# Altium project smart-water-quality-breakout.PrjPcb (part 4 of 5)

## Sheet main-power.SchDoc
size Letter
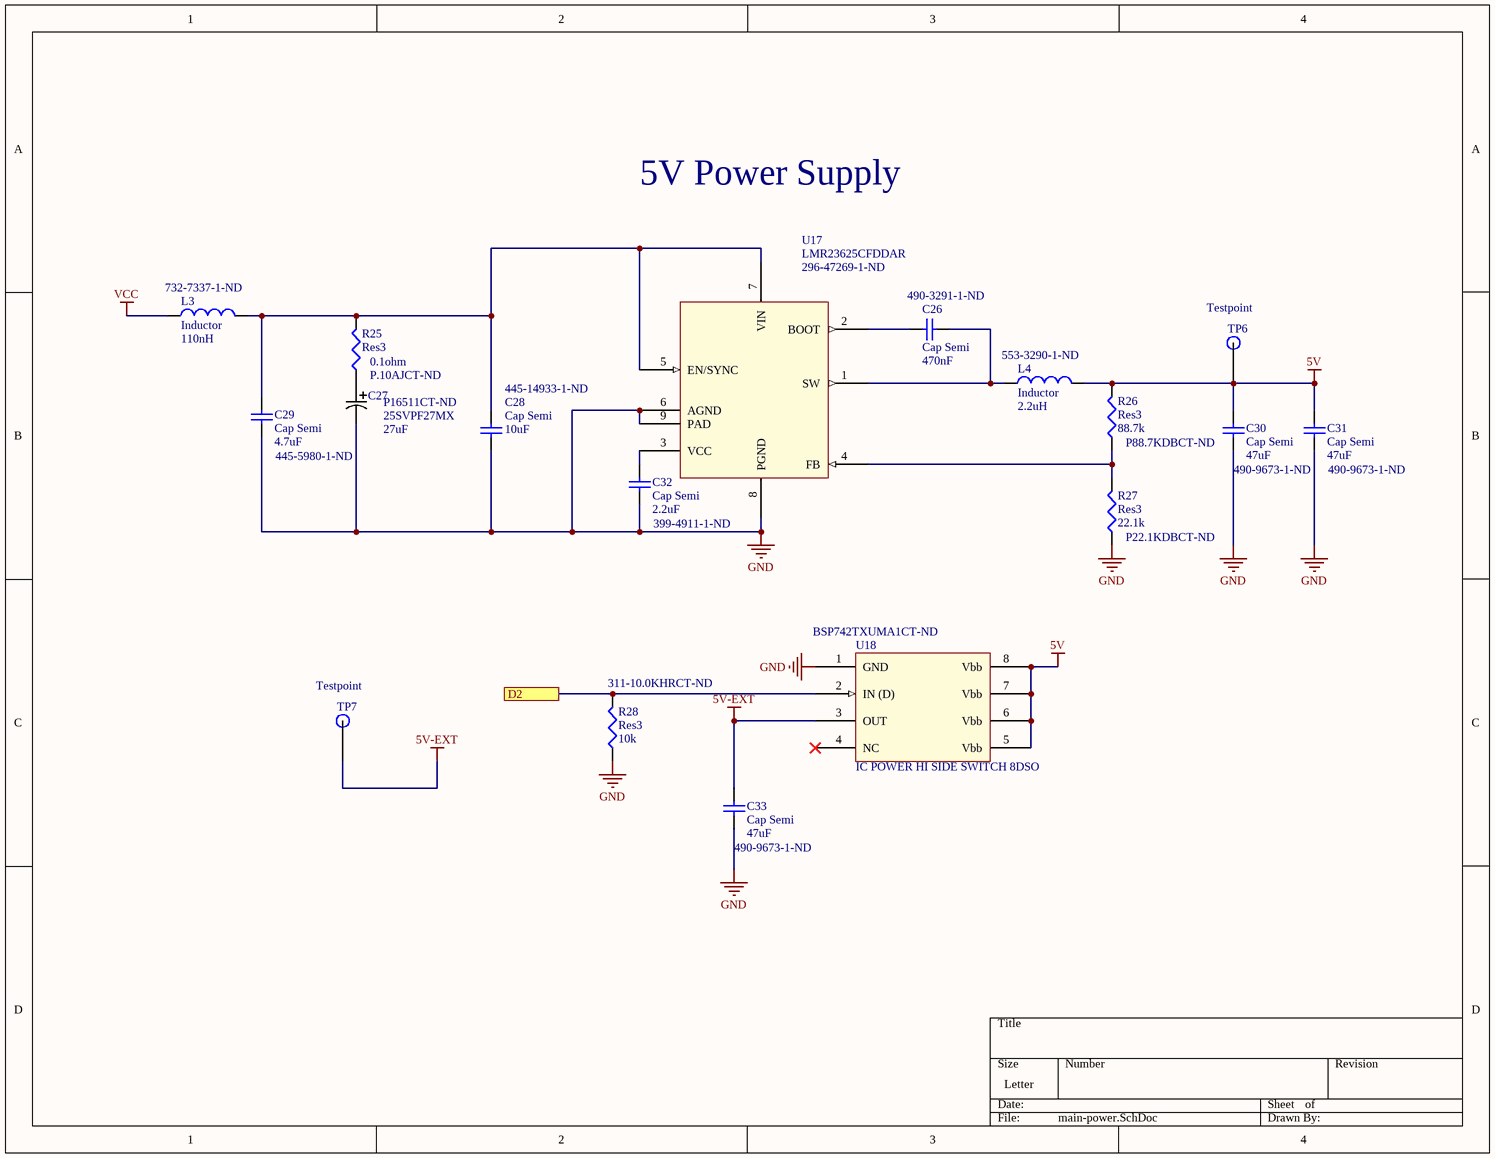
[diagram p3: main-power.SchDoc]

### Parts
C26  Cap Semi  value 470nF  Supplier Part Number 1: 490-3291-1-ND  [1608[0603]]
C27  Supplier Part Number 1: P16511CT-ND  Capacitance: 27uF  [PCAP_SVP_B6]  (hidden comment: Part Number: 25SVPF27MX)
C28  Cap Semi  value 10uF  Supplier Part Number 1: 445-14933-1-ND  [1210]
C29  Cap Semi  value 4.7uF  Supplier Part Number 1: 445-5980-1-ND  [0805C]
C30  Cap Semi  value 47uF  Supplier Part Number 1: 490-9673-1-ND  [C1206]
C31  Cap Semi  value 47uF  Supplier Part Number 1: 490-9673-1-ND  [C1206]
C32  Cap Semi  value 2.2uF  Supplier Part Number 1: 399-4911-1-ND  [1608[0603]]
C33  Cap Semi  value 47uF  Supplier Part Number 1: 490-9673-1-ND  [C1206]
L3  Inductor  value 110nH  Supplier Part Number 1: 732-7337-1-ND  [74479899111]
L4  Inductor  value 2.2uH  Supplier Part Number 1: 553-3290-1-ND  [PA4332.222NLT]
R25  Res3  value 0.1ohm  Supplier Part Number 1: P.10AJCT-ND  [J1-0603]
R26  Res3  value 88.7k  Supplier Part Number 1: P88.7KDBCT-ND  [J1-0603]
R27  Res3  value 22.1k  Supplier Part Number 1: P22.1KDBCT-ND  [J1-0603]
R28  Res3  value 10k  Supplier Part Number 1: 311-10.0KHRCT-ND  [J1-0603]
TP6  Testpoint  [testpoint]  (no BOM)
TP7  Testpoint  [testpoint]  (no BOM)
U17  LMR23625CFDDAR  Supplier Part Number 1: 296-47269-1-ND  [DDA0008E_L]
U18  IC POWER HI SIDE SWITCH 8DSO  Supplier Part Number 1: BSP742TXUMA1CT-ND  [SOIC127P600-8N]

### Ports
D2

### Nets
5V: C30.2 C31.2 L4.2 R26.2 TP6.1 U18.5(Vbb) U18.6(Vbb) U18.7(Vbb) U18.8(Vbb)
5V-EXT: C33.2 TP7.1 U18.3(OUT)
GND: C27.2 C28.1 C29.1 C30.1 C31.1 C32.1 C33.1 R27.1 R28.1 U17.6(AGND) U17.8(PGND) U17.9(PAD) U18.1(GND)
VCC: L3.1
NetC26_1: C26.1 U17.2(BOOT)
NetC26_2: C26.2 L4.1 U17.1(SW)
NetC27_1: C27.1 R25.1
NetC28_2: C28.2 C29.2 L3.2 R25.2 U17.5(EN/SYNC) U17.7(VIN)
NetC32_2: C32.2 U17.3(VCC)
NetR20_2: R28.2 U18.2(IN_(D)) ; port D2
NetR26_1: R26.1 R27.2 U17.4(FB)

Not connected (* = marked no-connect by the designer): U18 4(NC)*

### Notes on the sheet
- 5V Power Supply

### Library data of the parts
C26 = Cap Semi: Capacitor (Semiconductor SIM Model); Manufacturer: Murata; Manufacturer Part Number: GRM188R71E474KA12D; Material: Ceramic; Tolerance: 10%; Voltage Rating: 25V; Dielectric: X7R; Voltage: 50V; Published: 8-Jun-2000; LatestRevisionDate: 29-May-2009; LatestRevisionNote: IPC-7351 Footprint Added.; PackageReference: C1206; Publisher: Altium Limited; PackageDescription: Chip Capacitor; Supplier 1: Digi-Key; Stock 1: 187331; Pricing 1: 1 = 0.25000, 10 = 0.16800, 100 = 0.08520, 500 = 0.05832, 1000 = 0.05159 (USD); RoHS: Yes; Mount: Surface Mount; Case/Package: 0603; Number of Pins: 2; Case Code (Metric): 1608; Case Code (Imperial): 0603; Min Operating Temperature: -55°C; Max Operating Temperature: 125°C; Packaging: Tape and Reel; Capacitance: 470nF; Package Quantity: 4000; Voltage Rating (DC): 25V; Termination: SMD/SMT; Length: 1.6mm; Height: 0.8mm; Width: 0.031inch; Thickness: 0.035inch; Depth: 0.8mm; REACH SVHC: No SVHC; Lead Free: Lead Free; ComponentLink1URL: https://datasheet.ciiva.com/16293/grm188r71e474ka12d-16293088.pdf?src-supplier=Future+Electronics; ComponentLink1Description: https://datasheet.ciiva.com/16293/grm188r71e474ka12d-16293088.pdf?src-supplier=Future+Electronics; ComponentLink2URL: https://datasheet.ciiva.com/7937/1747458-7937650.pdf?src-supplier=Element14; ComponentLink2Description: https://datasheet.ciiva.com/7937/1747458-7937650.pdf?src-supplier=Element14; ComponentLink3URL: https://datasheet.ciiva.com/134/grm188r71e474ka12-01-134310.pdf?src-supplier=Digi-Key; ComponentLink3Description: https://datasheet.ciiva.com/134/grm188r71e474ka12-01-134310.pdf?src-supplier=Digi-Key; ComponentLink4URL: https://datasheet.ciiva.com/34302/1857559-34302862.pdf?src-supplier=Jameco; ComponentLink4Description: https://datasheet.ciiva.com/34302/1857559-34302862.pdf?src-supplier=Jameco; ComponentLink5URL: https://datasheet.ciiva.com/29199/454518-da-01-en-vs-kondensator-0603-29199596.pdf?src-supplier=Conrad; ComponentLink5Description: https://datasheet.ciiva.com/29199/454518-da-01-en-vs-kondensator-0603-29199596.pdf?src-supplier=Conrad; ComponentLink6URL: https://datasheet.ciiva.com/134/grm188r71e474ka12-01-134308.pdf?src-supplier=Digi-Key; ComponentLink6Description: https://datasheet.ciiva.com/134/grm188r71e474ka12-01-134308.pdf?src-supplier=Digi-Key; ComponentLink7URL: https://datasheet.ciiva.com/134/grm188r71e474ka12-01-134309.pdf?src-supplier=Digi-Key; ComponentLink7Description: https://datasheet.ciiva.com/134/grm188r71e474ka12-01-134309.pdf?src-supplier=Digi-Key; ComponentLink8URL: https://datasheet.ciiva.com/22703/1747458-22703340.pdf?src-supplier=Element14; ComponentLink8Description: https://datasheet.ciiva.com/22703/1747458-22703340.pdf?src-supplier=Element14
C27 = 25SVPF27MX: No Description Available; Vendor: Panasonic; Built_By: EMA_UL_Team; Type: DEV; Tolerance: 20%; Voltage Rating: 25V; ESR (Equivalent Series Resistance): 40mR; Ripple Current: 2.45A; Leakage Current: 135uA; Polarity: Polar; Life (Hours): 5000Hour; Dissipation Factor: 12%; Manufacturer_Part_Number: 25SVPF27MX; Copyright: Copyright (C) 2018 Accelerated Designs. All rights reserved; RefDes: RefDes; Value: Value; Supplier 1: Digi-Key; Manufacturer: Panasonic; Manufacturer Part Number: 25SVPF27MX; Stock 1: 3478; Pricing 1: 1 = 1.02000, 10 = 0.80900, 100 = 0.60650, 500 = 0.45826 (USD); RoHS: Yes; Mount: Surface Mount; Case/Package: Radial; Number of Pins: 6; Min Operating Temperature: -55°C; Max Operating Temperature: 105°C; Packaging: Tape and Reel; Voltage Rating (DC): 25V; Package Quantity: 1500; Ripple Current (AC): 2.45A; Termination: SMD/SMT; Voltage: 25V; Diameter: 5mm; Length: 5.9mm; Height: 5.9mm; Height - Seated (Max): 0.236inch; REACH SVHC: No SVHC; ComponentLink1URL: https://datasheet.ciiva.com/24094/svpf-os-262415-24094277.pdf?src-supplier=Mouser; ComponentLink1Description: https://datasheet.ciiva.com/24094/svpf-os-262415-24094277.pdf?src-supplier=Mouser; ComponentLink2URL: https://datasheet.ciiva.com/49031/70324301-49031162.pdf?src-supplier=Allied+Electronics; ComponentLink2Description: https://datasheet.ciiva.com/49031/70324301-49031162.pdf?src-supplier=Allied+Electronics; ComponentLink3URL: https://datasheet.ciiva.com/25746/1734360-25746540.pdf?src-supplier=Farnell; ComponentLink3Description: https://datasheet.ciiva.com/25746/1734360-25746540.pdf?src-supplier=Farnell; ComponentLink4URL: https://datasheet.ciiva.com/22746/1734360-22746216.pdf?src-supplier=Element14; ComponentLink4Description: https://datasheet.ciiva.com/22746/1734360-22746216.pdf?src-supplier=Element14
C28 = Cap Semi: Capacitor (Semiconductor SIM Model); Manufacturer: TDK; Manufacturer Part Number: C3225X7R1H106M250AC; Dielectric Material: Ceramic; Tolerance: 20%; Voltage Rating: 50V; Dielectric: X7R; Published: 8-Jun-2000; LatestRevisionDate: 29-May-2009; LatestRevisionNote: IPC-7351 Footprint Added.; PackageReference: C1206; Publisher: Altium Limited; PackageDescription: Chip Capacitor; Supplier 1: Digi-Key; Stock 1: 227657; Pricing 1: 1 = 1.57000, 10 = 1.24200, 100 = 0.93150, 500 = 0.70380 (USD); RoHS: Yes; Mount: Surface Mount; Case/Package: 1210; Weight: 0.000564oz; Case Code (Metric): 3225; Case Code (Imperial): 1210; Min Operating Temperature: -55°C; Max Operating Temperature: 125°C; Package Quantity: 1000; Packaging: Tape and Reel; Capacitance: 10uF; Termination: SMD/SMT; Voltage Rating (DC): 50V; Length: 0.126inch; Height: 2.5mm; Width: 0.098inch; Thickness: 0.11inch; REACH SVHC: No SVHC; Lead Free: Lead Free; ComponentLink1URL: http://www.farnell.com/datasheets/2291921.pdf?src-supplier=Farnell; ComponentLink1Description: http://www.farnell.com/datasheets/2291921.pdf?src-supplier=Farnell; ComponentLink2URL: http://www.mouser.com/ds/2/400/tdk_mlcc_commercial_general_en-542463.pdf?src-supplier=Mouser; ComponentLink2Description: http://www.mouser.com/ds/2/400/tdk_mlcc_commercial_general_en-542463.pdf?src-supplier=Mouser; ComponentLink3URL: https://product.tdk.com/info/en/documents/chara_sheet/C3225X7R1H106M250AC.pdf?src-supplier=Digi-Key; ComponentLink3Description: https://product.tdk.com/info/en/documents/chara_sheet/C3225X7R1H106M250AC.pdf?src-supplier=Digi-Key; ComponentLink4URL: http://product.tdk.com/capacitor/mlcc/en/documents/mlcc_commercial_general_en.pdf?src-supplier=Avnet; ComponentLink4Description: http://product.tdk.com/capacitor/mlcc/en/documents/mlcc_commercial_general_en.pdf?src-supplier=Avnet; ComponentLink5URL: http://www.farnell.com/datasheets/1913358.pdf?src-supplier=Element14; ComponentLink5Description: http://www.farnell.com/datasheets/1913358.pdf?src-supplier=Element14; ComponentLink6URL: http://www.farnell.com/datasheets/2291921.pdf?src-supplier=Newark; ComponentLink6Description: http://www.farnell.com/datasheets/2291921.pdf?src-supplier=Newark
C29 = Cap Semi: Capacitor (Semiconductor SIM Model); Manufacturer: TDK; Manufacturer Part Number: C2012X5R1H475K125AB; Dielectric Material: Ceramic; Tolerance: 10%; Voltage Rating: 50V; Dielectric: X5R; Published: 8-Jun-2000; LatestRevisionDate: 29-May-2009; LatestRevisionNote: IPC-7351 Footprint Added.; PackageReference: C1206; Publisher: Altium Limited; PackageDescription: Chip Capacitor; Supplier 1: Digi-Key; Stock 1: 412452; Pricing 1: 1 = 0.80000, 10 = 0.56600, 100 = 0.37260, 500 = 0.27600, 1000 = 0.23460 (USD); RoHS: Yes; Mount: Surface Mount; Case/Package: 0805; Weight: 0.000194oz; Case Code (Metric): 2012; Case Code (Imperial): 0805; Min Operating Temperature: -55°C; Max Operating Temperature: 85°C; Capacitance: 4.7uF; Packaging: Tape and Reel; Package Quantity: 1; Voltage Rating (DC): 50V; Termination: SMD/SMT; Composition: Ceramic; Voltage: 50V; Length: 2mm; Height: 1.25mm; Width: 0.049inch; Thickness: 0.057inch; Depth: 1.25mm; Radiation Hardening: No; REACH SVHC: No SVHC; Lead Free: Lead Free; ComponentLink1URL: https://datasheet.ciiva.com/24216/c2012x5r1h475k125ab-265006-24216434.pdf?src-supplier=Mouser; ComponentLink1Description: https://datasheet.ciiva.com/24216/c2012x5r1h475k125ab-265006-24216434.pdf?src-supplier=Mouser; ComponentLink2URL: https://datasheet.ciiva.com/28673/mlcc-commercial-general-en-28673541.pdf?src-supplier=Element14; ComponentLink2Description: https://datasheet.ciiva.com/28673/mlcc-commercial-general-en-28673541.pdf?src-supplier=Element14; ComponentLink3URL: https://datasheet.ciiva.com/17487/e412-c-17487414.pdf?src-supplier=Avnet+Europe; ComponentLink3Description: https://datasheet.ciiva.com/17487/e412-c-17487414.pdf?src-supplier=Avnet+Europe; ComponentLink4URL: https://datasheet.ciiva.com/22725/1913358-22725564.pdf?src-supplier=Element14; ComponentLink4Description: https://datasheet.ciiva.com/22725/1913358-22725564.pdf?src-supplier=Element14; ComponentLink5URL: https://datasheet.ciiva.com/6276/tdkmlcccaprange-6276526.pdf?src-supplier=Digi-Key; ComponentLink5Description: https://datasheet.ciiva.com/6276/tdkmlcccaprange-6276526.pdf?src-supplier=Digi-Key; ComponentLink6URL: https://datasheet.ciiva.com/48671/e412-c-48671374.pdf?src-supplier=Avnet; ComponentLink6Description: https://datasheet.ciiva.com/48671/e412-c-48671374.pdf?src-supplier=Avnet
C30 C31 C33 = Cap Semi: Capacitor (Semiconductor SIM Model); Manufacturer: Murata; Manufacturer Part Number: GRM31CR61A476KE15L; Material: Ceramic; Tolerance: 10%; Voltage Rating: 10V; Dielectric: X5R; Published: 8-Jun-2000; LatestRevisionDate: 29-May-2009; LatestRevisionNote: IPC-7351 Footprint Added.; PackageReference: C1206; Publisher: Altium Limited; PackageDescription: Chip Capacitor; Supplier 1: Digi-Key; Stock 1: 199340; Pricing 1: 1 = 0.84000, 10 = 0.63700, 100 = 0.45540, 500 = 0.35254, 1000 = 0.30357 (USD); RoHS: Yes; Mount: Surface Mount; Case/Package: 1206; Case Code (Metric): 3216; Case Code (Imperial): 1206; Min Operating Temperature: -55°C; Max Operating Temperature: 85°C; Package Quantity: 2000; Packaging: Tape and Reel; Capacitance: 47uF; Voltage Rating (DC): 10V; Termination: SMD/SMT; Voltage: 10V; Length: 3.2mm; Height: 1.6mm; Width: 1.6mm; Thickness: 0.071inch; Depth: 1.6mm; REACH SVHC: No SVHC; Lead Free: Lead Free; ComponentLink1URL: https://datasheet.ciiva.com/29536/grm31cr61a476ke15-01-29536840.pdf?src-supplier=Digi-Key; ComponentLink1Description: https://datasheet.ciiva.com/29536/grm31cr61a476ke15-01-29536840.pdf?src-supplier=Digi-Key; ComponentLink2URL: https://datasheet.ciiva.com/13337/product-13337807.pdf?src-supplier=Mouser; ComponentLink2Description: https://datasheet.ciiva.com/13337/product-13337807.pdf?src-supplier=Mouser; ComponentLink3URL: https://datasheet.ciiva.com/46445/1769893-46445005.pdf?src-supplier=Element14; ComponentLink3Description: https://datasheet.ciiva.com/46445/1769893-46445005.pdf?src-supplier=Element14; ComponentLink4URL: https://datasheet.ciiva.com/41860/partnumbering-e-01-41860758.pdf?src-supplier=Digi-Key; ComponentLink4Description: https://datasheet.ciiva.com/41860/partnumbering-e-01-41860758.pdf?src-supplier=Digi-Key; ComponentLink5URL: https://datasheet.ciiva.com/46445/1769893-46445004.pdf?src-supplier=Element14; ComponentLink5Description: https://datasheet.ciiva.com/46445/1769893-46445004.pdf?src-supplier=Element14
C32 = Cap Semi: Capacitor (Semiconductor SIM Model); Manufacturer: KEMET; Manufacturer Part Number: C0603C225K8PACTU; Dielectric Material: Ceramic; Tolerance: 10%; Dielectric: X5R; Voltage: 10V; Published: 8-Jun-2000; LatestRevisionDate: 29-May-2009; LatestRevisionNote: IPC-7351 Footprint Added.; PackageReference: C1206; Publisher: Altium Limited; PackageDescription: Chip Capacitor; Supplier 1: Digi-Key; Stock 1: 110745; Pricing 1: 1 = 0.24000, 10 = 0.16200, 100 = 0.08220, 500 = 0.05622, 1000 = 0.04973 (USD); RoHS: Yes; Mount: Surface Mount; Case/Package: 0603; Number of Pins: 2; Min Operating Temperature: -55°C; Max Operating Temperature: 85°C; Capacitance: 2.2uF; Packaging: Tape and Reel; Termination: SMD/SMT; Voltage Rating (DC): 10V; Length: 1.6mm; Height: 0.8mm; Depth: 0.8mm; Radiation Hardening: No; Lead Free: Lead Free; ComponentLink1URL: https://datasheet.ciiva.com/11786/0900766b8116eb59-11786922.pdf?src-supplier=RSComponents; ComponentLink1Description: https://datasheet.ciiva.com/11786/0900766b8116eb59-11786922.pdf?src-supplier=RSComponents; ComponentLink2URL: https://datasheet.ciiva.com/18192/getdatasheetpartid-104076-18192933.pdf?src-supplier=Verical; ComponentLink2Description: https://datasheet.ciiva.com/18192/getdatasheetpartid-104076-18192933.pdf?src-supplier=Verical; ComponentLink3URL: https://datasheet.ciiva.com/7824/40889-7824025.pdf?src-supplier=Element14; ComponentLink3Description: https://datasheet.ciiva.com/7824/40889-7824025.pdf?src-supplier=Element14; ComponentLink4URL: https://datasheet.ciiva.com/26847/getdatasheetpartid-316295-26847626.pdf?src-supplier=Verical; ComponentLink4Description: https://datasheet.ciiva.com/26847/getdatasheetpartid-316295-26847626.pdf?src-supplier=Verical
L3 = Inductor: Manufacturer: Wurth Electronics; Code_IEC: 1005; Current Rating: 4A; Shielding: Shielded; DC Resistance (DCR): 7mR; Self Resonant Frequency: 300MHz; Test Frequency: 1MHz; Tolerance: 20%; Published: 8-Jun-2000; LatestRevisionDate: 29-May-2009; LatestRevisionNote: IPC-7351 Footprint Added.; PackageReference: 0402-A; Publisher: Altium Limited; PackageDescription: Chip Inductor; Code_JEITA: 0402; Supplier 1: Digi-Key; Manufacturer Part Number: 74479899111; Stock 1: 5231; Pricing 1: 1 = 1.06000, 10 = 1.04200, 50 = 0.94100, 100 = 0.90700, 500 = 0.84000, 1000 = 0.77300 (USD); RoHS: Yes; Mount: Surface Mount; Case/Package: 1210; Case Code (Metric): 3225; Case Code (Imperial): 1210; Min Operating Temperature: -40°C; Max Operating Temperature: 125°C; Packaging: Tape and Reel; Inductance: 110nH; Saturation Current: 4A; Length: 0.126inch; Width: 0.102inch; Height - Seated (Max): 0.047inch; ComponentLink1URL: https://katalog.we-online.de/pbs/datasheet/74479899111.pdf?src-supplier=Digi-Key; ComponentLink1Description: https://katalog.we-online.de/pbs/datasheet/74479899111.pdf?src-supplier=Digi-Key
L4 = Inductor: Manufacturer: Pulse Electronics; Code_IEC: 1005; Core Material: Ferrite; Current Rating: 4.3A; Saturation Current: 6.1A; Shielding: Shielded; DC Resistance (DCR): 48mR; Self Resonant Frequency: 25MHz; Test Frequency: 1MHz; Tolerance: 20%; Published: 8-Jun-2000; LatestRevisionDate: 29-May-2009; LatestRevisionNote: IPC-7351 Footprint Added.; PackageReference: 0402-A; Publisher: Altium Limited; PackageDescription: Chip Inductor; Code_JEITA: 0402; Supplier 1: Digi-Key; Manufacturer Part Number: PA4332.222NLT; Stock 1: 9240; Pricing 1: 1 = 0.64000, 10 = 0.56400, 100 = 0.40250, 500 = 0.33810, 1000 = 0.27370 (USD); RoHS: Yes; Mount: Surface Mount; Case/Package: Nonstandard; Min Operating Temperature: -40°C; Max Operating Temperature: 125°C; Packaging: Tape and Reel; Composition: Wirewound; Inductance: 2.2uH; Length: 0.165inch; Width: 0.165inch; Height - Seated (Max): 0.079inch; ComponentLink1URL: http://products.pulseelex.com/files/product_files/P761.pdf?src-supplier=Digi-Key; ComponentLink1Description: http://products.pulseelex.com/files/product_files/P761.pdf?src-supplier=Digi-Key
R25 = Res3: Resistor; Manufacturer: Panasonic; Manufacturer Part Number: ERJ3RSFR10V; Resistance: 100mR; Power Rating: 100mW; Tolerance: 1%; Temperature Coefficient: 300ppm/°C; Published: 8-Jun-2000; LatestRevisionDate: 29-May-2009; LatestRevisionNote: IPC-7351 Footprint Added.; PackageReference: J1-0603; Publisher: Altium Limited; PackageDescription: Chip Resistor; Supplier 1: Digi-Key; Stock 1: 499056; Pricing 1: 1 = 0.31000, 10 = 0.26200, 25 = 0.19040, 50 = 0.13800, 100 = 0.10230, 250 = 0.07852, 500 = 0.06186, 1000 = 0.04283 (USD); RoHS: Yes; Mount: Surface Mount; Case/Package: 0603; Number of Pins: 2; Case Code (Metric): 1608; Case Code (Imperial): 0603; Contact Plating: Tin; Min Operating Temperature: -55°C; Max Operating Temperature: 125°C; Packaging: Tape and Reel; Package Quantity: 5000; Composition: Thick Film; Number of Terminations: 2; Termination: SMD/SMT; Military Standard: Not; Max Power Dissipation: 100mW; Length: 1.6mm; Height: 0.45mm; Width: 0.031inch; Depth: 0.8mm; Radiation Hardening: No; REACH SVHC: No SVHC; Lead Free: Lead Free; ComponentLink1URL: https://datasheet.ciiva.com/11818/0900766b80eefa12-11818379.pdf?src-supplier=RSComponents; ComponentLink1Description: https://datasheet.ciiva.com/11818/0900766b80eefa12-11818379.pdf?src-supplier=RSComponents; ComponentLink2URL: https://datasheet.ciiva.com/9186/aoa0000ce3-9186678.pdf?src-supplier=Avnet; ComponentLink2Description: https://datasheet.ciiva.com/9186/aoa0000ce3-9186678.pdf?src-supplier=Avnet; ComponentLink3URL: https://datasheet.ciiva.com/28577/391509-28577782.pdf?src-supplier=Element14; ComponentLink3Description: https://datasheet.ciiva.com/28577/391509-28577782.pdf?src-supplier=Element14; ComponentLink4URL: https://datasheet.ciiva.com/30245/6aoa0000ce3-30245798.pdf?src-supplier=Onlinecomponents.com; ComponentLink4Description: https://datasheet.ciiva.com/30245/6aoa0000ce3-30245798.pdf?src-supplier=Onlinecomponents.com; ComponentLink5URL: https://datasheet.ciiva.com/6137/391509-6137623.pdf?src-supplier=Farnell; ComponentLink5Description: https://datasheet.ciiva.com/6137/391509-6137623.pdf?src-supplier=Farnell; ComponentLink6URL: https://datasheet.ciiva.com/16396/aoa0000ce3-16396839.pdf?src-supplier=Future+Electronics; ComponentLink6Description: https://datasheet.ciiva.com/16396/aoa0000ce3-16396839.pdf?src-supplier=Future+Electronics; ComponentLink7URL: https://datasheet.ciiva.com/17208/aoa0000ce3-17208042.pdf?src-supplier=Avnet+Europe; ComponentLink7Description: https://datasheet.ciiva.com/17208/aoa0000ce3-17208042.pdf?src-supplier=Avnet+Europe; ComponentLink8URL: https://datasheet.ciiva.com/24027/aoa0000ce3-72189-24027996.pdf?src-supplier=Mouser; ComponentLink8Description: https://datasheet.ciiva.com/24027/aoa0000ce3-72189-24027996.pdf?src-supplier=Mouser; ComponentLink9URL: https://datasheet.ciiva.com/46449/391509-46449485.pdf?src-supplier=Element14; ComponentLink9Description: https://datasheet.ciiva.com/46449/391509-46449485.pdf?src-supplier=Element14; ComponentLink10URL: https://datasheet.ciiva.com/16771/70068852-16771902.pdf?src-supplier=Allied+Electronics; ComponentLink10Description: https://datasheet.ciiva.com/16771/70068852-16771902.pdf?src-supplier=Allied+Electronics; ComponentLink11URL: https://datasheet.ciiva.com/46449/391509-46449486.pdf?src-supplier=Element14; ComponentLink11Description: https://datasheet.ciiva.com/46449/391509-46449486.pdf?src-supplier=Element14; ComponentLink12URL: https://datasheet.ciiva.com/28667/391509-28667695.pdf?src-supplier=Element14; ComponentLink12Description: https://datasheet.ciiva.com/28667/391509-28667695.pdf?src-supplier=Element14
R26 = Res3: Resistor; Manufacturer: Panasonic; Manufacturer Part Number: ERA3AEB8872V; Tolerance: 0.1%; Resistance: 88.7kR; Temperature Coefficient: 25ppm/°C; Power Rating: 100mW; Voltage Rating: 75V; Published: 8-Jun-2000; LatestRevisionDate: 29-May-2009; LatestRevisionNote: IPC-7351 Footprint Added.; PackageReference: J1-0603; Publisher: Altium Limited; PackageDescription: Chip Resistor; Supplier 1: Digi-Key; Stock 1: 25375; Pricing 1: 1 = 0.35000, 10 = 0.30000, 100 = 0.11720, 1000 = 0.04906, 2500 = 0.04498 (USD); RoHS: Yes; Mount: Surface Mount; Case/Package: 0603; Number of Pins: 2; Contact Plating: Tin; Case Code (Imperial): 0603; Case Code (Metric): 1608; Min Operating Temperature: -55°C; Max Operating Temperature: 155°C; Composition: Metal Film; Packaging: Tape and Reel; Package Quantity: 1; Number of Terminations: 2; Military Standard: Not; Max Power Dissipation: 100mW; Voltage Rating (DC): 75V; Features: Automotive AEC-Q200; Length: 1.6mm; Height: 0.45mm; Width: 0.8mm; Depth: 0.8mm; Radiation Hardening: No; Lead Free: Lead Free; ComponentLink1URL: https://datasheet.ciiva.com/11810/0900766b80eb1d8c-11810560.pdf?src-supplier=RSComponents; ComponentLink1Description: https://datasheet.ciiva.com/11810/0900766b80eb1d8c-11810560.pdf?src-supplier=RSComponents; ComponentLink2URL: https://datasheet.ciiva.com/7920/485442-7920389.pdf?src-supplier=Element14; ComponentLink2Description: https://datasheet.ciiva.com/7920/485442-7920389.pdf?src-supplier=Element14; ComponentLink3URL: https://datasheet.ciiva.com/6053/485442-6053174.pdf?src-supplier=Farnell; ComponentLink3Description: https://datasheet.ciiva.com/6053/485442-6053174.pdf?src-supplier=Farnell; ComponentLink4URL: https://datasheet.ciiva.com/6053/485442-6053175.pdf?src-supplier=Farnell; ComponentLink4Description: https://datasheet.ciiva.com/6053/485442-6053175.pdf?src-supplier=Farnell; ComponentLink5URL: https://datasheet.ciiva.com/6053/485442-6053177.pdf?src-supplier=Farnell; ComponentLink5Description: https://datasheet.ciiva.com/6053/485442-6053177.pdf?src-supplier=Farnell; ComponentLink6URL: https://datasheet.ciiva.com/17208/aoa0000ce26-17208382.pdf?src-supplier=Avnet+Europe; ComponentLink6Description: https://datasheet.ciiva.com/17208/aoa0000ce26-17208382.pdf?src-supplier=Avnet+Europe
R27 = Res3: Resistor; Manufacturer: Panasonic; Manufacturer Part Number: ERA-3AEB2212V; Tolerance: 0.1%; Resistance: 22.1kR; Power Rating: 100mW; Voltage Rating: 150V; Temperature Coefficient: 25ppm/°C; Voltage Rating (DC): 75V; Published: 8-Jun-2000; LatestRevisionDate: 29-May-2009; LatestRevisionNote: IPC-7351 Footprint Added.; PackageReference: J1-0603; Publisher: Altium Limited; PackageDescription: Chip Resistor; Supplier 1: Digi-Key; Stock 1: 138256; Pricing 1: 1 = 0.35000, 10 = 0.30000, 100 = 0.11720, 1000 = 0.04906, 2500 = 0.04498 (USD); RoHS: Yes; Mount: Surface Mount; Case/Package: 0603; Number of Pins: 2; Case Code (Metric): 1608; Case Code (Imperial): 0603; Contact Plating: Tin; Min Operating Temperature: -55°C; Max Operating Temperature: 155°C; Packaging: Tape and Reel; Package Quantity: 1; Composition: Thin Film; Number of Terminations: 2; Military Standard: Not; Max Power Dissipation: 100mW; Features: Automotive AEC-Q200; Termination: SMD/SMT; Length: 1.6mm; Height: 0.45mm; Width: 0.8mm; Depth: 0.8mm; Radiation Hardening: No; REACH SVHC: No SVHC; Lead Free: Lead Free; ComponentLink1URL: https://datasheet.ciiva.com/11810/0900766b80eb1d8c-11810643.pdf?src-supplier=RSComponents; ComponentLink1Description: https://datasheet.ciiva.com/11810/0900766b80eb1d8c-11810643.pdf?src-supplier=RSComponents; ComponentLink2URL: https://datasheet.ciiva.com/29183/452175-da-01-en-widerstand-0603-era-29183955.pdf?src-supplier=Conrad; ComponentLink2Description: https://datasheet.ciiva.com/29183/452175-da-01-en-widerstand-0603-era-29183955.pdf?src-supplier=Conrad; ComponentLink3URL: https://datasheet.ciiva.com/17210/aoa0000ce26-17210837.pdf?src-supplier=Avnet+Europe; ComponentLink3Description: https://datasheet.ciiva.com/17210/aoa0000ce26-17210837.pdf?src-supplier=Avnet+Europe; ComponentLink4URL: https://datasheet.ciiva.com/5998/485442-5998316.pdf?src-supplier=Farnell; ComponentLink4Description: https://datasheet.ciiva.com/5998/485442-5998316.pdf?src-supplier=Farnell; ComponentLink5URL: https://datasheet.ciiva.com/9191/aoa0000ce26-9191805.pdf?src-supplier=Avnet; ComponentLink5Description: https://datasheet.ciiva.com/9191/aoa0000ce26-9191805.pdf?src-supplier=Avnet; ComponentLink6URL: https://datasheet.ciiva.com/5998/485442-5998319.pdf?src-supplier=Farnell; ComponentLink6Description: https://datasheet.ciiva.com/5998/485442-5998319.pdf?src-supplier=Farnell; ComponentLink7URL: https://datasheet.ciiva.com/46422/485442-46422607.pdf?src-supplier=Element14; ComponentLink7Description: https://datasheet.ciiva.com/46422/485442-46422607.pdf?src-supplier=Element14
R28 = Res3: Resistor; Manufacturer: Yageo; Manufacturer Part Number: RC0603FR-0710KL; Tolerance: 1%; Resistance: 10kR; Temperature Coefficient: 100ppm/°C; Voltage Rating (DC): 50V; Power Rating: 100mW; Voltage Rating: 75V; Published: 8-Jun-2000; LatestRevisionDate: 29-May-2009; LatestRevisionNote: IPC-7351 Footprint Added.; PackageReference: J1-0603; Publisher: Altium Limited; PackageDescription: Chip Resistor; Supplier 1: Digi-Key; Stock 1: 90146690; Pricing 1: 1 = 0.10000, 10 = 0.02400, 100 = 0.00970, 1000 = 0.00437, 2500 = 0.00379 (USD); RoHS: Yes; Case/Package: 0603; Number of Pins: 2; Weight: 7.1E-05oz; Case Code (Imperial): 0603; Case Code (Metric): 1608; Min Operating Temperature: -55°C; Max Operating Temperature: 155°C; Composition: Thick Film; Packaging: Tape and Reel; Military Standard: Not; Termination: SMD/SMT; Length: 1.6mm; Height: 0.45mm; Width: 0.8mm; Depth: 0.8mm; Lead Pitch: 0.3mm; REACH SVHC: No SVHC; Lead Free: Lead Free; ComponentLink1URL: https://datasheet.ciiva.com/7660/38590-7660789.pdf?src-supplier=Element14; ComponentLink1Description: https://datasheet.ciiva.com/7660/38590-7660789.pdf?src-supplier=Element14; ComponentLink2URL: https://datasheet.ciiva.com/15189/getdatasheetpartid-409289-15189591.pdf?src-supplier=Verical; ComponentLink2Description: https://datasheet.ciiva.com/15189/getdatasheetpartid-409289-15189591.pdf?src-supplier=Verical; ComponentLink3URL: https://datasheet.ciiva.com/46440/1868787-46440891.pdf?src-supplier=Element14; ComponentLink3Description: https://datasheet.ciiva.com/46440/1868787-46440891.pdf?src-supplier=Element14; ComponentLink4URL: https://datasheet.ciiva.com/7983/443971-7983596.pdf?src-supplier=Element14; ComponentLink4Description: https://datasheet.ciiva.com/7983/443971-7983596.pdf?src-supplier=Element14; ComponentLink5URL: https://datasheet.ciiva.com/7746/1738695-7746239.pdf?src-supplier=Element14; ComponentLink5Description: https://datasheet.ciiva.com/7746/1738695-7746239.pdf?src-supplier=Element14; ComponentLink6URL: https://datasheet.ciiva.com/22747/443971-22747519.pdf?src-supplier=Element14; ComponentLink6Description: https://datasheet.ciiva.com/22747/443971-22747519.pdf?src-supplier=Element14
TP6 TP7 = SMT Testpoint
U17 = LMR23625CFDDAR: Manufacturer: Texas Instruments; Quiescent Current: 75uA; Supplier 1: Digi-Key; Manufacturer Part Number: LMR23625CFDDAR; Stock 1: 6768; Pricing 1: 1 = 3.24000, 10 = 2.91200, 100 = 2.38610, 500 = 2.03124, 1000 = 1.71310 (USD); RoHS: No; Min Operating Temperature: -40°C; Max Operating Temperature: 125°C; Lead Free: Lead Free; ComponentLink1URL: http://www.ti.com/lit/ds/symlink/lmr23625.pdf?src-supplier=Digi-Key; ComponentLink1Description: http://www.ti.com/lit/ds/symlink/lmr23625.pdf?src-supplier=Digi-Key
U18 = BSP742TXUMA1: Manufacturer: Infineon; Output Current: 800mA; Number of Outputs: 1; Nominal Supply Current: 1mA; Max Power Dissipation: 1.5W; Max Supply Voltage: 34V; Supplier 1: Digi-Key; Manufacturer Part Number: BSP742TXUMA1; Stock 1: 10093; Pricing 1: 1 = 1.73000, 10 = 1.53200, 100 = 1.21050, 500 = 0.93878, 1000 = 0.74115 (USD); RoHS: Yes; Mount: Surface Mount; Number of Pins: 8; Min Operating Temperature: -40°C; Max Operating Temperature: 150°C; Packaging: Tape and Reel; Number of Channels: 1; Power Dissipation: 1.5W; Radiation Hardening: No; Lead Free: Lead Free; Halogen Free: Halogen Free; ComponentLink1URL: http://components.arrow.com/part/dataview/52118417S8296913N2051?src-supplier=Arrow; ComponentLink1Description: http://components.arrow.com/part/dataview/52118417S8296913N2051?src-supplier=Arrow; ComponentLink2URL: http://www.farnell.com/datasheets/2333312.pdf?src-supplier=Farnell; ComponentLink2Description: http://www.farnell.com/datasheets/2333312.pdf?src-supplier=Farnell; ComponentLink3URL: http://components.arrow.com/part/dataview/0323_00171565?src-supplier=Arrow+Europe; ComponentLink3Description: http://components.arrow.com/part/dataview/0323_00171565?src-supplier=Arrow+Europe; ComponentLink4URL: http://www.mouser.com/ds/2/196/Infineon-BSP742T-DS-v01_03-EN-1111163.pdf?src-supplier=Mouser; ComponentLink4Description: http://www.mouser.com/ds/2/196/Infineon-BSP742T-DS-v01_03-EN-1111163.pdf?src-supplier=Mouser; ComponentLink5URL: http://www.infineon.com/dgdl/Infineon-BSP742T-DS-v01_03-en.pdf?fileId=db3a30431689f4420116d2efc3000bf7&ack=t&src-supplier=Avnet; ComponentLink5Description: http://www.infineon.com/dgdl/Infineon-BSP742T-DS-v01_03-en.pdf?fileId=db3a30431689f4420116d2efc3000bf7&ack=t&src-supplier=Avnet; ComponentLink6URL: https://www.infineon.com/dgdl/Infineon-BSP742T-DS-v01_03-EN.pdf?fileId=5546d4625a888733015aae0b51d34c49&src-supplier=Digi-Key; ComponentLink6Description: https://www.infineon.com/dgdl/Infineon-BSP742T-DS-v01_03-EN.pdf?fileId=5546d4625a888733015aae0b51d34c49&src-supplier=Digi-Key; ComponentLink7URL: http://www.farnell.com/datasheets/2333312.pdf?src-supplier=Newark; ComponentLink7Description: http://www.farnell.com/datasheets/2333312.pdf?src-supplier=Newark

## Sheet gps.SchDoc
size Letter
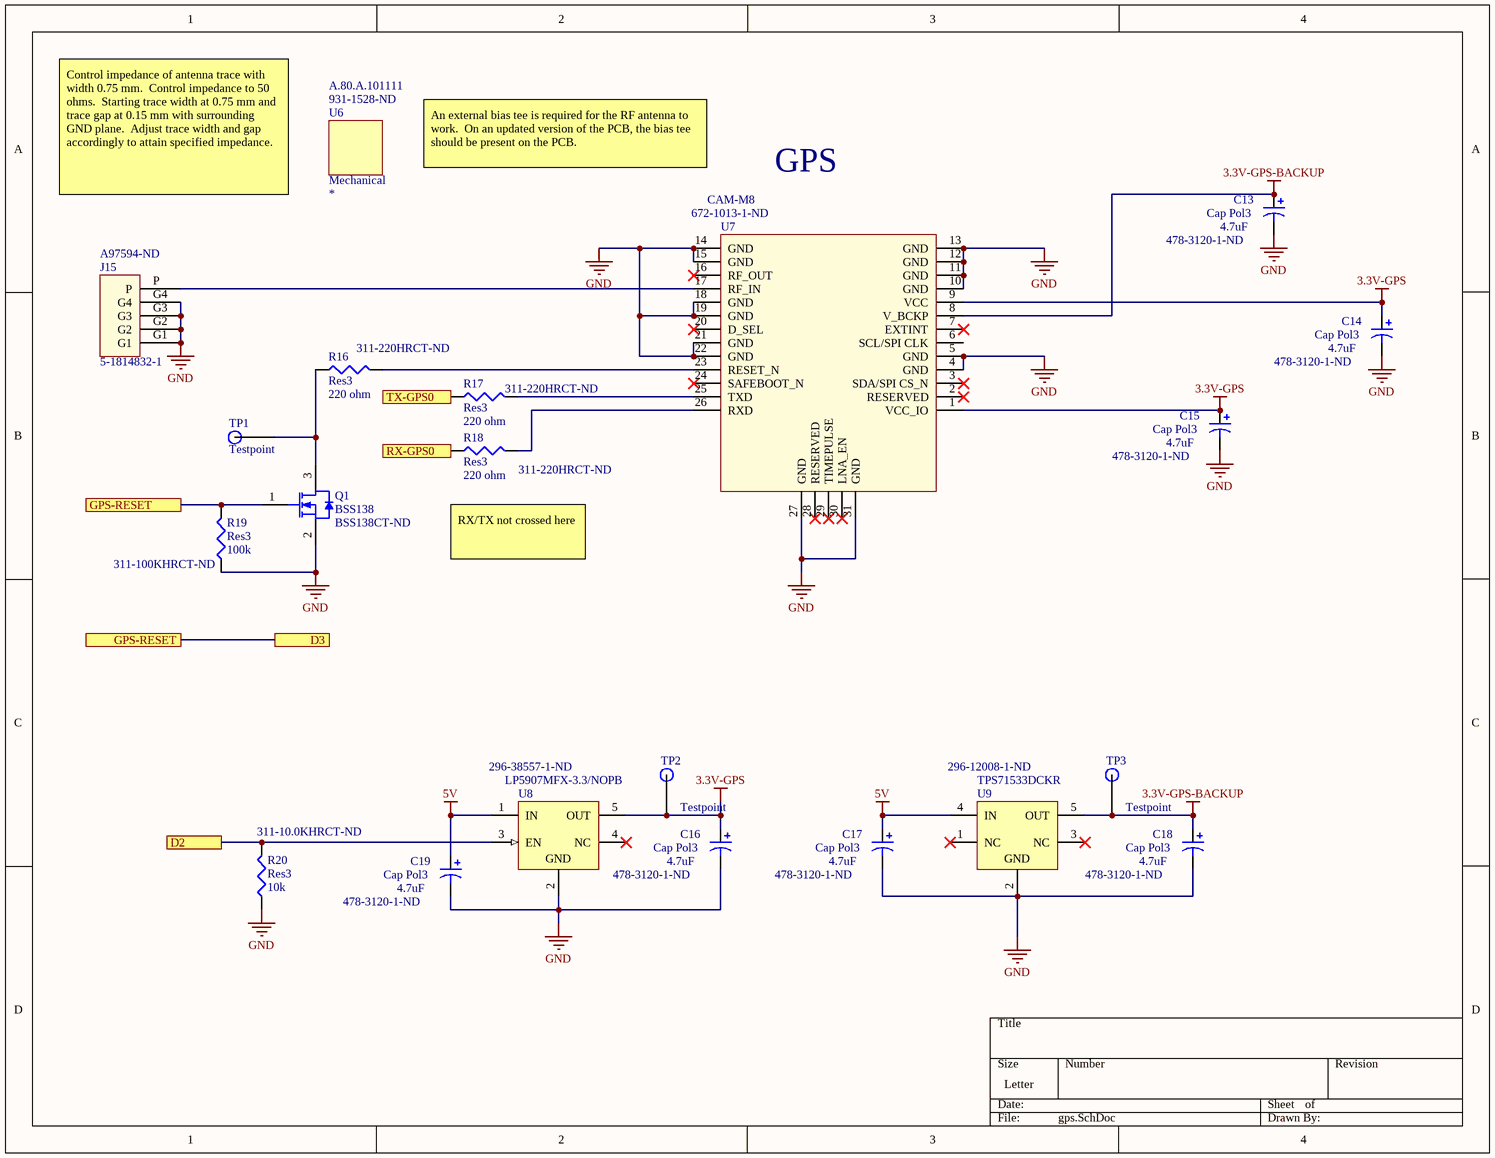
[diagram p4: gps.SchDoc]

### Parts
C13  Cap Pol3  value 4.7uF  Supplier Part Number 1: 478-3120-1-ND  [1206-pol]
C14  Cap Pol3  value 4.7uF  Supplier Part Number 1: 478-3120-1-ND  [1206-pol]
C15  Cap Pol3  value 4.7uF  Supplier Part Number 1: 478-3120-1-ND  [1206-pol]
C16  Cap Pol3  value 4.7uF  Supplier Part Number 1: 478-3120-1-ND  [1206-pol]
C17  Cap Pol3  value 4.7uF  Supplier Part Number 1: 478-3120-1-ND  [1206-pol]
C18  Cap Pol3  value 4.7uF  Supplier Part Number 1: 478-3120-1-ND  [1206-pol]
C19  Cap Pol3  value 4.7uF  Supplier Part Number 1: 478-3120-1-ND  [1206-pol]
J15  5-1814832-1  Supplier Part Number 1: A97594-ND  [5-1814832-1]
Q1  BSS138  Supplier Part Number 1: BSS138CT-ND  [FAIR-SOT23-3_V]
R16  Res3  value 220 ohm  Supplier Part Number 1: 311-220HRCT-ND  [J1-0603]
R17  Res3  value 220 ohm  Supplier Part Number 1: 311-220HRCT-ND  [J1-0603]
R18  Res3  value 220 ohm  Supplier Part Number 1: 311-220HRCT-ND  [J1-0603]
R19  Res3  value 100k  Supplier Part Number 1: 311-100KHRCT-ND  [J1-0603]
R20  Res3  value 10k  Supplier Part Number 1: 311-10.0KHRCT-ND  [J1-0603]
TP1  Testpoint  [testpoint]  (no BOM)
TP2  Testpoint  [testpoint]  (no BOM)
TP3  Testpoint  [testpoint]  (no BOM)
U6  Mechanical  Supplier Part Number 2: 931-1528-ND  Manufacturer Part Number: A.80.A.101111  (mechanical)
U7  CAM-M8  Supplier Part Number 1: 672-1013-1-ND  [CAM]
U8  LP5907MFX-3.3/NOPB  Supplier Part Number 1: 296-38557-1-ND  [DBV0005A_L]
U9  TPS71533DCKR  Supplier Part Number 1: 296-12008-1-ND  [DCK0005A_L]

### Ports
D2, D3, GPS-RESET, RX-GPS0, TX-GPS0

### Nets
3.3V-GPS: C14.1 C15.1 C16.1 TP2.1 U7.1(VCC_IO) U7.9(VCC) U8.5(OUT)
3.3V-GPS-BACKUP: C13.1 C18.1 TP3.1 U7.8(V_BCKP) U9.5(OUT)
5V: C17.1 C19.1 U8.1(IN) U9.4(IN)
GND: C13.2 C14.2 C15.2 C16.2 C17.2 C18.2 C19.2 J15.G1 J15.G2 J15.G3 J15.G4 Q1.2(S) R19.1 R20.1 U7.4(GND) U7.5(GND) U7.10(GND) U7.11(GND) U7.12(GND) U7.13(GND) U7.14(GND) U7.15(GND) U7.18(GND) U7.19(GND) U7.21(GND) U7.22(GND) U7.27(GND) U7.31(GND) U8.2(GND) U9.2(GND)
NetJ15_P: J15.P U7.17(RF_IN)
NetQ1_1: Q1.1(G) R19.2 ; port GPS-RESET, port D3
NetQ1_3: Q1.3(D) R16.1 TP1.1
NetR16_2: R16.2 U7.23(RESET_N)
NetR17_1: R17.1 ; port TX-GPS0
NetR17_2: R17.2 U7.25(TXD)
NetR18_1: R18.1 ; port RX-GPS0
NetR18_2: R18.2 U7.26(RXD)
NetR20_2: R20.2 U8.3(EN) ; port D2

Not connected (* = marked no-connect by the designer): U7 2(RESERVED)* 3(SDA/SPI_CS_N)* 6(SCL/SPI_CLK) 7(EXTINT)* 16(RF_OUT)* 20(D_SEL)* 24(SAFEBOOT_N)* 28(RESERVED)* 29(TIMEPULSE)* 30(LNA_EN)*; U8 4(NC)*; U9 1(NC)* 3(NC)*

### Notes on the sheet
- An external bias tee is required for the RF antenna to work.  On an updated version of the PCB, the bias tee should be present on the PCB.
- (near U6) Control impedance of antenna trace with width 0.75 mm.  Control impedance to 50 ohms.  Starting trace width at 0.75 mm and trace gap at 0.15 mm with surrounding GND plane.  Adjust trace width and gap accordingly to attain specified impedance.
- GPS
- RX/TX not crossed here

### Library data of the parts
C13-C19 = Cap Pol3: Polarized Capacitor (Surface Mount); Manufacturer: AVX Corporation; Manufacturer Part Number: NOJA475M010RWJ; Manufacturer Size Code: A; Tolerance: ±20%; Dissipation Factor: 6%; Supplier 1: Digi-Key; RoHS: RoHS Compliant; Category: Capacitors; Stock 1: 5356; Pricing 1: 1=0.68, 10=0.485, 100=0.319, 500=0.2363, 1000=0.20086 (CAD); Packaging: Cut Tape (CT); Part Status: Active; Mounting Type: Surface Mount; Package / Case: 1206 (3216 Metric); Height - Seated (Max): 0.071" (1.80mm); Features: -; Operating Temperature: -55°C ~ 105°C; Supplier Device Package: 1206 (3216 Metric); Size / Dimension: 0.126" L x 0.063" W (3.20mm x 1.60mm); ComponentLink1URL: http://datasheets.avx.com/NOJ.pdf; ComponentLink1Description: http://datasheets.avx.com/NOJ.pdf
J15 = 5-1814832-1: Manufacturer: TE Connectivity; Body Material: Zinc; Plating: Nickel; Body Plating: Gold; Dielectric Material: PTFE; Impedance: 50R; Frequency: 3GHz; Gender: Female; Connector Type: SMA; Polarity: Normal; Wire/Cable Type: Coaxial; Insulation Resistance: 5GR; Connector System: Cable-to-Board; Number of Positions: 1; Sealable: No (Without); Tail Length: 4mm; Supplier 1: Digi-Key; Manufacturer Part Number: 5-1814832-1; Stock 1: 34232; Pricing 1: 1 = 1.99000, 10 = 1.80400, 25 = 1.69360, 50 = 1.62000, 100 = 1.54640, 250 = 1.39908, 500 = 1.28864, 1000 = 1.10454 (USD); RoHS: Yes; Mount: Through Hole; Case/Package: SMA; Contact Material: Bronze; Contact Plating: Gold; Insulation Material: Polytetrafluoroethylene; Min Operating Temperature: -67°C; Max Operating Temperature: 185°C; Package Quantity: 1; Fastening Type: Threaded; Packaging: Box; Termination: Through Hole; Max Frequency: 3GHz; Orientation: Straight; Length: 0.532inch; Depth: 6.4mm; Radiation Hardening: No; REACH SVHC: No SVHC; Lead Free: Lead Free; ELV: Compliant; ComponentLink1URL: https://datasheet.ciiva.com/642/eng-cd-1814832-b1-642785.pdf?src-supplier=Digi-Key; ComponentLink1Description: https://datasheet.ciiva.com/642/eng-cd-1814832-b1-642785.pdf?src-supplier=Digi-Key; ComponentLink2URL: https://datasheet.ciiva.com/642/eng-cd-1814832-b1-642785.pdf?src-supplier=Avnet; ComponentLink2Description: https://datasheet.ciiva.com/642/eng-cd-1814832-b1-642785.pdf?src-supplier=Avnet; ComponentLink3URL: https://datasheet.ciiva.com/23783/1663582-23783560.pdf?src-supplier=Newark; ComponentLink3Description: https://datasheet.ciiva.com/23783/1663582-23783560.pdf?src-supplier=Newark; ComponentLink4URL: https://datasheet.ciiva.com/16318/5-1814832-1-16318587.pdf?src-supplier=Future+Electronics; ComponentLink4Description: https://datasheet.ciiva.com/16318/5-1814832-1-16318587.pdf?src-supplier=Future+Electronics; ComponentLink5URL: https://datasheet.ciiva.com/11762/0900766b80a70d0f-11762254.pdf?src-supplier=RSComponents; ComponentLink5Description: https://datasheet.ciiva.com/11762/0900766b80a70d0f-11762254.pdf?src-supplier=RSComponents; ComponentLink6URL: https://datasheet.ciiva.com/26824/getdatasheetpartid-396696-26824822.pdf?src-supplier=Verical; ComponentLink6Description: https://datasheet.ciiva.com/26824/getdatasheetpartid-396696-26824822.pdf?src-supplier=Verical; ComponentLink7URL: https://datasheet.ciiva.com/30201/eng-cd-1814832-a-30201302.pdf?src-supplier=Onlinecomponents.com; ComponentLink7Description: https://datasheet.ciiva.com/30201/eng-cd-1814832-a-30201302.pdf?src-supplier=Onlinecomponents.com; ComponentLink8URL: https://datasheet.ciiva.com/25908/eng-cd-1814832-a-25908583.pdf?src-supplier=Avnet+Europe; ComponentLink8Description: https://datasheet.ciiva.com/25908/eng-cd-1814832-a-25908583.pdf?src-supplier=Avnet+Europe; ComponentLink9URL: https://datasheet.ciiva.com/16469/eng-cd-1814832-a-16469256.pdf?src-supplier=Avnet+Asia; ComponentLink9Description: https://datasheet.ciiva.com/16469/eng-cd-1814832-a-16469256.pdf?src-supplier=Avnet+Asia
Q1 = CMP-1670-00009-1: N-Channel Logic Level Enhancement Mode Field Effect Transistor, 220 mA, 50 V, -55 to 150 degC, 3-Pin SOT-23, RoHS, Tape and Reel; Manufacturer: Fairchild/ON Semiconductor; ESR: 40 Ohm; Tolerance: 30ppm; Capacitance: 1.8E-11 f; Load Capacitance: 18 pF; Frequency: 12 MHz; Resistance: 100 Ohm; Drain to Source Voltage (Vdss): 50V; Current - Continuous Drain (Id) @ 25°C: 220mA (Ta); Drive Voltage (Max Rds On,  Min Rds On): 4.5V, 10V; Vgs(th) (Max) @ Id: 1.5V @ 1mA; Gate Charge (Qg) (Max) @ Vgs: 2.4nC @ 10V; Input Capacitance (Ciss) (Max) @ Vds: 27pF @ 25V; Vgs (Max): ±20V; Power Dissipation (Max): 360mW (Ta); Rds On (Max) @ Id, Vgs: 3.5 Ohm @ 220mA, 10V; Min Operating Temperature: -20degC; ComponentLink2URL: https://www.fairchildsemi.com/datasheets/BS/BSS138.pdf; Max Operating Temperature: 70degC; Width: 0.126 inch; Pins: 4; Length: 0.197 inch; ComponentLink2Description: Datasheet; Package Quantity: 1; PackageReference: SOT23-3; Packaging: Tape and Reel; RoHSCompliant: True; Frequency Tolerance: 30ppm; ComponentLink3Description: Package Specification; Mount: Surface Mount; REACH SVHC: Unknown; Height: 0.041 inch; ComponentLink1URL: https://www.fairchildsemi.com/; PackageDescription: 3-Pin Small Outline Transistor, Body 2.92 x 1.325 mm, Pitch 0.95 mm; ComponentLink3URL: http://www.fairchildsemi.com/dwg/MA/MA03D.pdf; ComponentLink1Description: Manufacturer URL; DatasheetVersion: Rev. C, 10/2005; Supplier 1: Digi-Key; Manufacturer Part Number: BSS138; RoHS: RoHS Compliant; Category: Discrete Semiconductor Products; Stock 1: 450063; Pricing 1: 1=0.31, 10=0.252, 100=0.1339, 500=0.0881, 1000=0.05991 (CAD); Part Status: Active; FET Type: N-Channel; Technology: MOSFET (Metal Oxide); FET Feature: -; Operating Temperature: -55°C ~ 150°C (TJ); Mounting Type: Surface Mount; Supplier Device Package: SOT-23-3; Package / Case: TO-236-3, SC-59, SOT-23-3
R16-R18 = Res3: Resistor; Manufacturer: Yageo; Manufacturer Part Number: RC0603FR-07220RL; Tolerance: ±1%; Power (Watts): 0.1W, 1/10W; Temperature Coefficient: ±100ppm/°C; Published: 8-Jun-2000; LatestRevisionDate: 29-May-2009; LatestRevisionNote: IPC-7351 Footprint Added.; PackageReference: J1-0603; Publisher: Altium Limited; PackageDescription: Chip Resistor; Supplier 1: Digi-Key; RoHS: RoHS Compliant; Category: Resistors; Stock 1: 1006774; Pricing 1: 1=0.14, 10=0.021, 100=0.0086, 1000=0.00383, 2500=0.00333 (CAD); Packaging: Cut Tape (CT); Part Status: Active; Composition: Thick Film; Features: Moisture Resistant; Operating Temperature: -55°C ~ 155°C; Package / Case: 0603 (1608 Metric); Supplier Device Package: 0603; Size / Dimension: 0.063" L x 0.032" W (1.60mm x 0.80mm); Height - Seated (Max): 0.022" (0.55mm); Failure Rate: -; ComponentLink1URL: http://www.yageo.com/documents/recent/PYu-RC_Group_51_RoHS_L_7.pdf; ComponentLink1Description: http://www.yageo.com/documents/recent/PYu-RC_Group_51_RoHS_L_7.pdf
R19 = Res3: Resistor; Manufacturer: Yageo; Manufacturer Part Number: RC0603FR-07100KL; Tolerance: ±1%; Power (Watts): 0.1W, 1/10W; Temperature Coefficient: ±100ppm/°C; Published: 8-Jun-2000; LatestRevisionDate: 29-May-2009; LatestRevisionNote: IPC-7351 Footprint Added.; PackageReference: J1-0603; Publisher: Altium Limited; PackageDescription: Chip Resistor; Supplier 1: Digi-Key; RoHS: RoHS Compliant; Category: Resistors; Stock 1: 8279421; Pricing 1: 1=0.14, 10=0.021, 100=0.0086, 1000=0.00383, 2500=0.00333 (CAD); Packaging: Cut Tape (CT); Part Status: Active; Composition: Thick Film; Features: Moisture Resistant; Operating Temperature: -55°C ~ 155°C; Package / Case: 0603 (1608 Metric); Supplier Device Package: 0603; Size / Dimension: 0.063" L x 0.032" W (1.60mm x 0.80mm); Height - Seated (Max): 0.022" (0.55mm); Failure Rate: -; ComponentLink1URL: http://www.yageo.com/documents/recent/PYu-RC_Group_51_RoHS_L_7.pdf; ComponentLink1Description: http://www.yageo.com/documents/recent/PYu-RC_Group_51_RoHS_L_7.pdf
R20 = Res3: as R28 on sheet main-power; Published: 8-Jun-2000; LatestRevisionDate: 29-May-2009; LatestRevisionNote: IPC-7351 Footprint Added.; PackageReference: J1-0603; Publisher: Altium Limited; PackageDescription: Chip Resistor; Supplier 1: Digi-Key; Stock 1: 90146690; Pricing 1: 1 = 0.10000, 10 = 0.02400, 100 = 0.00970, 1000 = 0.00437, 2500 = 0.00379 (USD); RoHS: Yes; Case/Package: 0603; Number of Pins: 2; Weight: 7.1E-05oz; Case Code (Imperial): 0603; Case Code (Metric): 1608; Min Operating Temperature: -55°C; Max Operating Temperature: 155°C; Composition: Thick Film; Packaging: Tape and Reel; Military Standard: Not; Termination: SMD/SMT; Length: 1.6mm; Height: 0.45mm; Width: 0.8mm; Depth: 0.8mm; Lead Pitch: 0.3mm; REACH SVHC: No SVHC; Lead Free: Lead Free; ComponentLink1URL: https://datasheet.ciiva.com/7660/38590-7660789.pdf?src-supplier=Element14; ComponentLink1Description: https://datasheet.ciiva.com/7660/38590-7660789.pdf?src-supplier=Element14; ComponentLink2URL: https://datasheet.ciiva.com/15189/getdatasheetpartid-409289-15189591.pdf?src-supplier=Verical; ComponentLink2Description: https://datasheet.ciiva.com/15189/getdatasheetpartid-409289-15189591.pdf?src-supplier=Verical; ComponentLink3URL: https://datasheet.ciiva.com/46440/1868787-46440891.pdf?src-supplier=Element14; ComponentLink3Description: https://datasheet.ciiva.com/46440/1868787-46440891.pdf?src-supplier=Element14; ComponentLink4URL: https://datasheet.ciiva.com/7983/443971-7983596.pdf?src-supplier=Element14; ComponentLink4Description: https://datasheet.ciiva.com/7983/443971-7983596.pdf?src-supplier=Element14; ComponentLink5URL: https://datasheet.ciiva.com/7746/1738695-7746239.pdf?src-supplier=Element14; ComponentLink5Description: https://datasheet.ciiva.com/7746/1738695-7746239.pdf?src-supplier=Element14; ComponentLink6URL: https://datasheet.ciiva.com/22747/443971-22747519.pdf?src-supplier=Element14; ComponentLink6Description: https://datasheet.ciiva.com/22747/443971-22747519.pdf?src-supplier=Element14
TP1-TP3 = SMT Testpoint
U6 = Mechanical part: Manufacturer: Taoglas; Supplier Part Number 1: *; Supplier 2: Digi-Key; Stock 2: 12; Pricing 2: 1 = 97.25000, 10 = 91.17000, 25 = 86.91600, 100 = 82.05340 (USD)
U7 = CAM-M8: u-blox CAM GNSS antenna module; Manufacturer Part Number: CAM-M8Q-0; Frequency: 1.575GHz; Sensitivity: -167dBm; Modulation or Protocol: BeiDou, GLONASS, GNSS, GPS; Current - Receiving: 29mA; Data Interface: SPI, UART; Antenna Connector: On-Board, Chip; Voltage - Supply: 1.6 V ~ 3.6 V; Manufacturer: u-blox; Part Description: u-blox CAM GNSS antenna module; Value: CAM-M8; Supplier 1: Digi-Key; RoHS: RoHS Compliant; Category: RF/IF and RFID; Stock 1: 1338; Pricing 1: 1=47.18, 10=40.627, 50=26.4008, 100=18.256 (CAD); Packaging: Cut Tape (CT); Part Status: Active; Data Rate (Max): -; Applications: General Purpose; Memory Size: -; Features: -; Operating Temperature: -40°C ~ 85°C; Package / Case: 31-SMD Module; Supplier Device Package: Module; ComponentLink1URL: https://www.u-blox.com/sites/default/files/CAM-M8-FW3_DataSheet_(UBX-15031574).pdf; ComponentLink1Description: https://www.u-blox.com/sites/default/files/CAM-M8-FW3_DataSheet_(UBX-15031574).pdf
U8 = CMP-2000-07464-1: Ultra-Low-Noise, Low-IQ LDO, 0.25 A, Fixed 3.3 V Output, 2.2 to 5.5 V Input, -40 to 125 degC, 5-Pin SOT-23 (DBV), Green (RoHS & no Sb/Br), Tape and Reel; Manufacturer: Texas Instruments; Max Output Current: 250mA; Max Input Voltage: 5.5V; Dropout Voltage: 250mV; Number of Regulators: 1; Nominal Output Voltage: 3.3V; Output Voltage Accuracy: 2%; Polarity: Positive; Min Input Voltage: 2.2V; Package Version: 4073253-4/N, 12/2014; Quiescent Current: 425uA; Power Supply Rejection Ratio (PSRR): 82dB; Case\/Package: SOT-23; Lead Free: LeadFree; Package Reference: DBV5; Output Current: 250mA; Package Description: 5-Pin Small Outline Transistor, Body 2.9 x 1.6 mm, Pitch 0.95 mm; Max Operating Temperature: 125degC; Mounting Technology: SurfaceMount; Number of Pins: 5; Mount: SurfaceMount; Manufacturer URL: http://www.ti.com/; Accuracy: 2%; Package URL: http://www.ti.com/lit/ml/mpds018l/mpds018l.pdf; Output Voltage: 3.3V; Radiation Hardening: No; Number of Outputs: 1; Packaging: TapeandReel; RoHSCompliant: true; Min Operating Temperature: -40degC; Datasheet URL: http://www.ti.com/lit/ds/symlink/lp5907.pdf; Package Quantity: 3000; Datasheet Version: Rev. L, 09/2016; REACH SVHC: NoSVHC; Contact Plating: Tin; Supplier 1: Digi-Key; Manufacturer Part Number: LP5907MFX-3.3/NOPB; Stock 1: 414376; Pricing 1: 1 = 0.55000, 10 = 0.47500, 100 = 0.35470, 500 = 0.27872, 1000 = 0.21537 (USD); RoHS: Yes; Case/Package: SOT-23; Output Type: Fixed; ComponentLink1URL: https://datasheet.ciiva.com/15083/lp5907-15083592.pdf?src-supplier=Digi-Key; ComponentLink1Description: https://datasheet.ciiva.com/15083/lp5907-15083592.pdf?src-supplier=Digi-Key; ComponentLink2URL: https://datasheet.ciiva.com/48475/lp5907-48475084.pdf?src-supplier=Avnet; ComponentLink2Description: https://datasheet.ciiva.com/48475/lp5907-48475084.pdf?src-supplier=Avnet
U9 = CMP-0394-00925-2: Single Output LDO, 50 mA, Fixed 3.3 V Output, 3 to 24 V Input, 5-pin SC70 (DCK), -40 to 85 degC, Green (RoHS & no Sb/Br); Manufacturer: Texas Instruments; Accuracy(%): 4; Vdo(Typ)(mV): 415; Vin(Min)(V): 3; Iq(Typ)(mA): 0.003; Fixed Output Options(V): 3.3; SubFamily: Single Channel LDO; Iout(Max)(A): 0.05; Vin(Max)(V): 24; Dropout Voltage: 415mV; Output Current: 50mA; Number of Outputs: 1; Output Voltage: 3.3V; Max Power Dissipation: 320mW; Max Input Voltage: 24V; Min Input Voltage: 3V; Min Current Limit: 125mA; Input Bias Current: 3.2uA; Polarity: Positive; Quiescent Current: 3uA; Accuracy: 4%; Min Supply Voltage: 2.5V; ComponentLink3Description: Package Specification; ComponentLink1URL: http://www.ti.com/; ComponentLink3URL: http://www.ti.com/litv/pdf/mpds025f; PackageDescription: 5-Pin Plastic Small-Outline, Body 2 x 1.25 mm, Pitch 0.65 mm; PartNumber: TPS71533DCKR; Vout Adj(Min)(V): 3.3; ComponentLink2URL: http://www.ti.com/general/docs/lit/getliterature.tsp?genericPartNumber=TPS71533&fileType=pdf; ComponentLink2Description: Datasheet; ComponentLink1Description: Manufacturer URL; Code_JEDEC: MO-203; Vout Adj(Max)(V): 3.3; Mounting Technology: Surface Mount; DatasheetVersion: SLVS338P; Eco-Plan: Green (RoHS & no Sb/Br); PackageVersion: 4093553-3/G; PackageReference: DCK0005A; Supplier 1: Digi-Key; Manufacturer Part Number: TPS71533DCKR; Stock 1: 159612; Pricing 1: 1 = 0.90000, 10 = 0.80200, 100 = 0.62540, 500 = 0.51664, 1000 = 0.40788 (USD); RoHS: Yes; Case/Package: SC; Number of Pins: 5; Min Operating Temperature: -40°C; Max Operating Temperature: 125°C; Package Quantity: 3000; Packaging: Tape and Reel; Power Rating: 320mW; Max Output Current: 50mA; Number of Regulators: 1; Min Output Voltage: 3.3V; Power Dissipation: 320mW; Output Voltage Accuracy: 4%; Max Output Voltage: 3.3V; Output Type: Fixed; Nominal Output Voltage: 3.3V; Termination: SMD/SMT; Current Rating: 50mA; Length: 2mm; Height: 0.9mm; Width: 1.25mm; Radiation Hardening: No; Lead Free: Lead Free; REACH SVHC: No SVHC; ComponentLink4URL: https://datasheet.ciiva.com/22700/1835023-22700176.pdf?src-supplier=Element14; ComponentLink4Description: https://datasheet.ciiva.com/22700/1835023-22700176.pdf?src-supplier=Element14; ComponentLink5URL: https://datasheet.ciiva.com/27051/1116751-27051464.pdf?src-supplier=Jameco; ComponentLink5Description: https://datasheet.ciiva.com/27051/1116751-27051464.pdf?src-supplier=Jameco; ComponentLink6URL: https://datasheet.ciiva.com/7992/1854688-7992972.pdf?src-supplier=Element14; ComponentLink6Description: https://datasheet.ciiva.com/7992/1854688-7992972.pdf?src-supplier=Element14